# EAGLE schematic GWLSensorv4 (EAGLE 9.5.2)
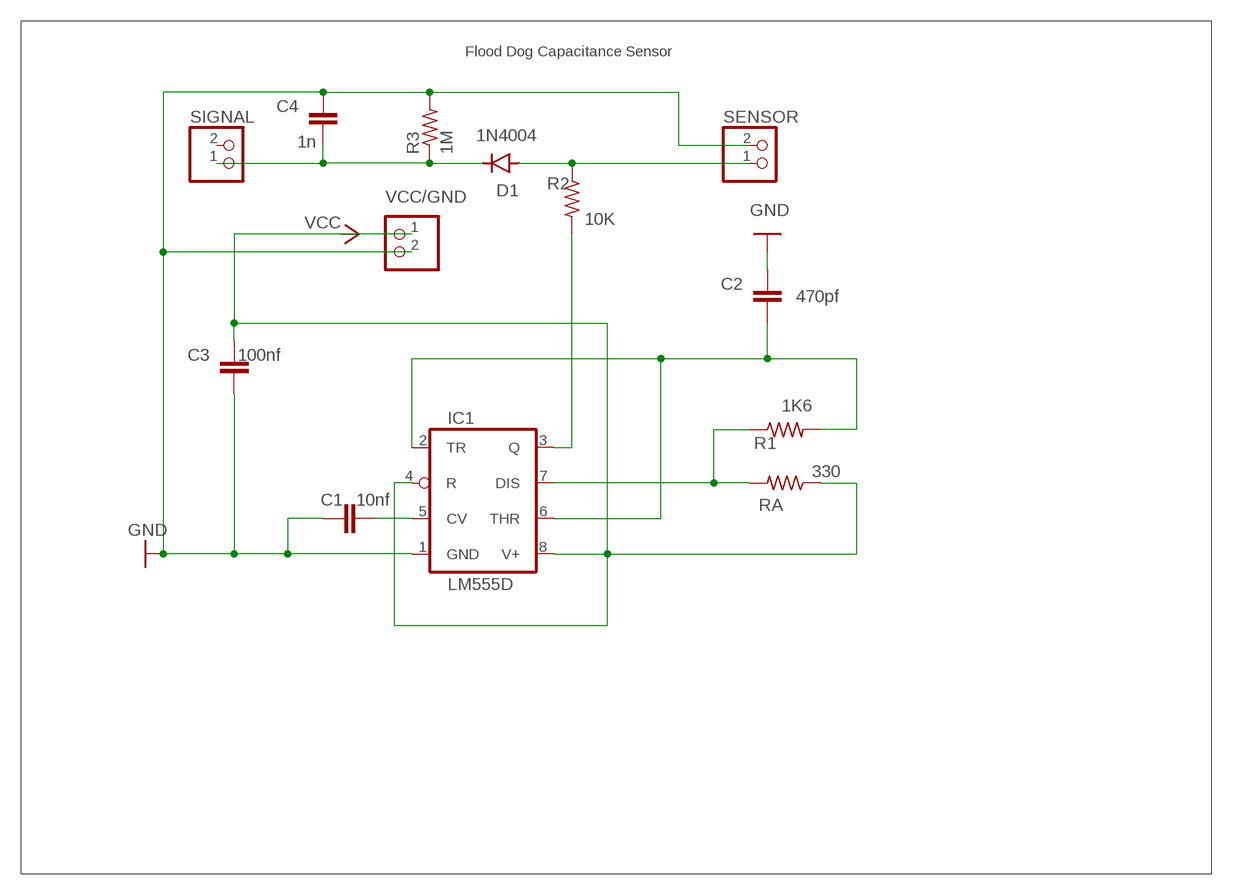
[diagram p0: schematic, sheet 1]

## Parts
C1  10nf  C-EUC0805  [C0805]
C2  470pf  C-EUC0805  [C0805]
C3  100nf  C-EUC0805  [C0805]
C4  1n  C-EUC0805  [C0805]
D1  1N4004  [DO41-10]
IC1  LM555D  [SO08]
R1  1K6  R-US_R0805  [R0805]
R2  10K  R-US_R0805  [R0805]
R3  1M  R-US_R0805  [R0805]
RA  330  R-US_R0805  [R0805]
SENSOR  JST_2PIN-SMT  [JST-PH-2-SMT]
SIGNAL  JST_2PIN-SMT  [JST-PH-2-SMT]
VCC/GND  JST_2PIN-SMT  [JST-PH-2-SMT]

## Nets
GND: C1.1 C2.2 C3.1 C4.2 IC1.1(GND) R3.2 SENSOR.2 VCC/GND.2
N$1: C4.1 D1.C R3.1 SIGNAL.1
N$2: IC1.7(DIS) R1.1 RA.2
N$3: C2.1 IC1.2(TR) IC1.6(THR) R1.2
N$4: C1.2 IC1.5(CV)
N$6: D1.A R2.1 SENSOR.1
N$7: IC1.3(Q) R2.2
VCC: C3.2 IC1.4(R) IC1.8(V+) RA.1 VCC/GND.1
Unconnected: SIGNAL.2

## Notes on the sheet
- Flood Dog Capacitance Sensor

## Library data of the parts
C1-C4 = rcl:C-EU: CAPACITOR, European symbol
D1 = diode:1N4004: DIODE general purpose rectifier, 1 A
IC1 = linear:*555: TIMER
R1-R3 RA = rcl:R-US_: RESISTOR, American symbol
SENSOR SIGNAL VCC/GND = adafruit:JST_2PIN: JST 2-Pin Connectors of various flavors SMT-RA (S2B-PH-SM4) 4UConnector #17311 SMT (B2B-PH-SM4) THM-RA (S2B-PH) THM (B2B-PH)